# EAGLE design A-15430 (EAGLE 7.7.0)
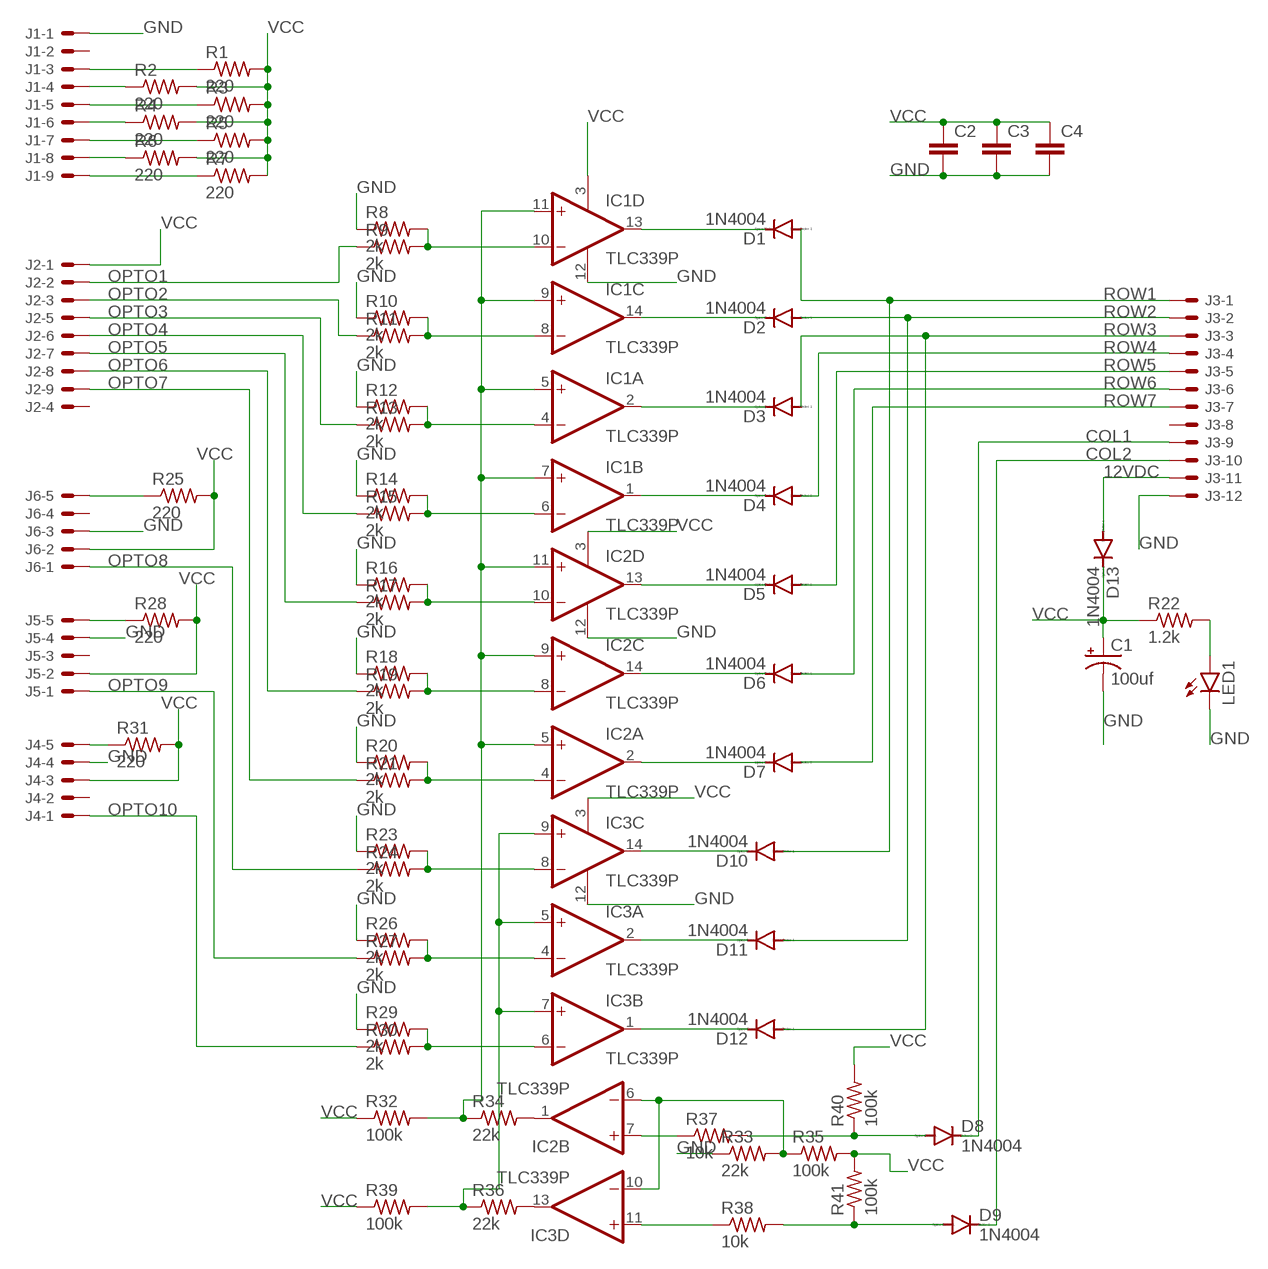
[diagram p0: schematic, sheet 1]

## Parts
C1  100uf  CPOL-USE2.5-5  [E2,5-5]
C2  C2.5/4  [C2.5-4]
C3  C2.5/4  [C2.5-4]
C4  C2.5/4  [C2.5-4]
D1  1N4004  [DO41-10]
D2  1N4004  [DO41-10]
D3  1N4004  [DO41-10]
D4  1N4004  [DO41-10]
D5  1N4004  [DO41-10]
D6  1N4004  [DO41-10]
D7  1N4004  [DO41-10]
D8  1N4004  [DO41-10]
D9  1N4004  [DO41-10]
D10  1N4004  [DO41-10]
D11  1N4004  [DO41-10]
D12  1N4004  [DO41-10]
D13  1N4004  [DO41-10]
IC1  TLC339P  [DIL14]
IC2  TLC339P  [DIL14]
IC3  TLC339P  [DIL14]
J1  KK-156-9  [KK-156-9]
J2  KK-156-9  [KK-156-9]
J3  KK-156-12  [KK-156-12]
J4  KK-156-5  [KK-156-5]
J5  KK-156-5  [KK-156-5]
J6  KK-156-5  [KK-156-5]
LED1  LED5MM  [LED5MM]
R1  220  R-US_0617/22  [0617/22]
R2  220  R-US_0617/22  [0617/22]
R3  220  R-US_0617/22  [0617/22]
R4  220  R-US_0617/22  [0617/22]
R5  220  R-US_0617/22  [0617/22]
R6  220  R-US_0617/22  [0617/22]
R7  220  R-US_0617/22  [0617/22]
R8  2k  R-US_0207/10  [0207/10]
R9  2k  R-US_0207/10  [0207/10]
R10  2k  R-US_0207/10  [0207/10]
R11  2k  R-US_0207/10  [0207/10]
R12  2k  R-US_0207/10  [0207/10]
R13  2k  R-US_0207/10  [0207/10]
R14  2k  R-US_0207/10  [0207/10]
R15  2k  R-US_0207/10  [0207/10]
R16  2k  R-US_0207/10  [0207/10]
R17  2k  R-US_0207/10  [0207/10]
R18  2k  R-US_0207/10  [0207/10]
R19  2k  R-US_0207/10  [0207/10]
R20  2k  R-US_0207/10  [0207/10]
R21  2k  R-US_0207/10  [0207/10]
R22  1.2k  R-US_0207/10  [0207/10]
R23  2k  R-US_0207/10  [0207/10]
R24  2k  R-US_0207/10  [0207/10]
R25  220  R-US_0617/22  [0617/22]
R26  2k  R-US_0207/10  [0207/10]
R27  2k  R-US_0207/10  [0207/10]
R28  220  R-US_0617/22  [0617/22]
R29  2k  R-US_0207/10  [0207/10]
R30  2k  R-US_0207/10  [0207/10]
R31  220  R-US_0617/22  [0617/22]
R32  100k  R-US_0207/10  [0207/10]
R33  22k  R-US_0207/10  [0207/10]
R34  22k  R-US_0207/10  [0207/10]
R35  100k  R-US_0207/10  [0207/10]
R36  22k  R-US_0207/10  [0207/10]
R37  10k  R-US_0207/10  [0207/10]
R38  10k  R-US_0207/10  [0207/10]
R39  100k  R-US_0207/10  [0207/10]
R40  100k  R-US_0207/10  [0207/10]
R41  100k  R-US_0207/10  [0207/10]

## Nets
12VDC [VCC]: D13.A J3.11
COL1: D8.C J3.9
COL2: D9.C J3.10
GND [GND]: C1.- C2.2 C3.2 C4.2 IC1.12(P:V-) IC2.12(P:V-) IC3.12(P:V-) J1.1 J3.12 J4.4 J5.4 J6.3 LED1.K(C) R8.1 R10.1 R12.1 R14.1 R16.1 R18.1 R20.1 R23.1 R26.1 R29.1 R33.1
N$1: D1.C IC1.13(D:OUT)
N$2: D2.C IC1.14(C:OUT)
N$3: D3.C IC1.2(A:OUT)
N$4: D4.C IC1.1(B:OUT)
N$5: J6.5 R25.1
N$6: LED1.A R22.2
N$8: J1.3 R1.1
N$9: D5.C IC2.13(D:OUT)
N$10: J1.4 R2.1
N$11: J1.5 R3.1
N$12: D6.C IC2.14(C:OUT)
N$13: J1.6 R4.1
N$14: D7.C IC2.2(A:OUT)
N$15: J1.7 R5.1
N$16: J1.8 R6.1
N$17: IC1.10(D:-IN) R8.2 R9.2
N$18: IC1.8(C:-IN) R10.2 R11.2
N$19: IC1.4(A:-IN) R12.2 R13.2
N$20: IC1.6(B:-IN) R14.2 R15.2
N$21: IC2.10(D:-IN) R16.2 R17.2
N$22: IC2.8(C:-IN) R18.2 R19.2
N$23: IC2.4(A:-IN) R20.2 R21.2
N$24: IC3.8(C:-IN) R23.2 R24.2
N$25: IC3.4(A:-IN) R26.2 R27.2
N$26: IC3.6(B:-IN) R29.2 R30.2
N$27: IC2.6(B:-IN) IC3.10(D:-IN) R33.2 R35.1
N$28: D10.C IC3.14(C:OUT)
N$29: D11.C IC3.2(A:OUT)
N$30: D12.C IC3.1(B:OUT)
N$31: J5.5 R28.1
N$32: IC3.13(D:OUT) R36.2
N$33: IC1.5(A:+IN) IC1.7(B:+IN) IC1.9(C:+IN) IC1.11(D:+IN) IC2.5(A:+IN) IC2.9(C:+IN) IC2.11(D:+IN) R32.2 R34.1
N$34: J4.5 R31.1
N$35: D9.A R38.2 R41.1
N$36: IC3.5(A:+IN) IC3.7(B:+IN) IC3.9(C:+IN) R36.1 R39.2
N$37: IC3.11(D:+IN) R38.1
N$38: J1.9 R7.1
N$39: D8.A R37.2 R40.1
N$40: IC2.1(B:OUT) R34.2
N$41: IC2.7(B:+IN) R37.1
OPTO1: J2.2 R9.1
OPTO2: J2.3 R11.1
OPTO3: J2.5 R13.1
OPTO4: J2.6 R15.1
OPTO5: J2.7 R17.1
OPTO6: J2.8 R19.1
OPTO7: J2.9 R21.1
OPTO8: J6.1 R24.1
OPTO9: J5.1 R27.1
OPTO10: J4.1 R30.1
ROW1: D1.A D10.A J3.1
ROW2: D2.A D11.A J3.2
ROW3: D3.A D12.A J3.3
ROW4: D4.A J3.4
ROW5: D5.A J3.5
ROW6: D6.A J3.6
ROW7: D7.A J3.7
VCC [VCC]: C1.+ C2.1 C3.1 C4.1 D13.C IC1.3(P:V+) IC2.3(P:V+) IC3.3(P:V+) J2.1 J4.3 J5.2 J6.2 R1.2 R2.2 R3.2 R4.2 R5.2 R6.2 R7.2 R22.1 R25.2 R28.2 R31.2 R32.1 R35.2 R39.1 R40.2 R41.2
Unconnected: J1.2 J2.4 J3.8 J4.2 J5.3 J6.4

## Library data of the parts
C1 = rcl:CPOL-US: POLARIZED CAPACITOR, American symbol; SPICEPREFIX: C
C2-C4 = capacitor-wima:C: CAPACITOR naming: grid - package width
D1-D13 = diode:1N4004: DIODE general purpose rectifier, 1 A
IC1-IC3 = linear:TLC339: COMPARATOR
J1 J2 = con-molex:KK-156-9: KK 156 HEADER Source: http://www.molex.com/pdm_docs/sd/026604100_sd.pdf; OC_FARNELL: unknown; OC_NEWARK: unknown
J3 = con-molex:KK-156-12: KK 156 HEADER Source: http://www.molex.com/pdm_docs/sd/026604100_sd.pdf; OC_FARNELL: unknown; OC_NEWARK: unknown
J4-J6 = con-molex:KK-156-5: KK 156 HEADER Source: http://www.molex.com/pdm_docs/sd/026604100_sd.pdf; OC_FARNELL: unknown; OC_NEWARK: unknown
LED1 = led:LED: LED OSRAM: - CHIPLED LG R971, LG N971, LY N971, LG Q971, LY Q971, LO R971, LY R971 LH N974, LH R974 LS Q976, LO Q976, LY Q976 LO Q996 - Hyper CHIPLED LW Q18S LB Q993, LB Q99A, LB R99A - SideLED LS A670, LO A670, LY A670, LG A670, LP A670 LB A673, LV A673, LT A673, LW A673 LH A674 LY A675 LS A676, LA A676, LO A676, LY A676, LW A676 LS A679, LY A679, LG A679 - Hyper Micro SIDELED® LS Y876, LA Y876, LO Y876, LY Y876 LT Y87S - SmartLED LW L88C, LW L88S LB L89C, LB L89S, LG L890 LS L89K, LO L89K, LY L89K LS L896, LA L896, LO L896, LY L896 - TOPLED LS T670, LO T670, LY T670, LG T670, LP T670 LSG T670, LSP T670, LSY T670, LOP T670, LYG T670 LG T671, LOG T671, LSG T671 LB T673, LV T673, LT T673, LW T673 LH T674 LS T676, LA T676, LO T676, LY T676, LB T676, LH T676, LSB T676, LW T676 LB T67C, LV T67C, LT T67C, LS T67K, LO T67K, LY T67K, LW E67C LS E67B, LA E67B, LO E67B, LY E67B, LB E67C, LV E67C, LT E67C LW T67C LS T679, LY T679, LG T679 LS T770, LO T770, LY T770, LG T770, LP T770 LB T773, LV T773, LT T773, LW T773 LH T774 LS E675, LA E675, LY E675, LS T675 LS T776, LA T776, LO T776, LY T776, LB T776 LHGB T686 LT T68C, LB T68C - Hyper Mini TOPLED® LB M676 - Mini TOPLED Santana® LG M470 LS M47K, LO M47K, LY M47K Source: http://www.osram.convergy.de LUXEON: - LUMILED® LXK2-PW12-R00, LXK2-PW12-S00, LXK2-PW14-U00, LXK2-PW14-V00 LXK2-PM12-R00, LXK2-PM12-S00, LXK2-PM14-U00 LXK2-PE12-Q00, LXK2-PE12-R00, LXK2-PE12-S00, LXK2-PE14-T00, LXK2-PE14-U00 LXK2-PB12-K00, LXK2-PB12-L00, LXK2-PB12-M00, LXK2-PB14-N00, LXK2-PB14-P00, LXK2-PB14-Q00 LXK2-PR12-L00, LXK2-PR12-M00, LXK2-PR14-Q00, LXK2-PR14-R00 LXK2-PD12-Q00, LXK2-PD12-R00, LXK2-PD12-S00 LXK2-PH12-R00, LXK2-PH12-S00 LXK2-PL12-P00, LXK2-PL12-Q00, LXK2-PL12-R00 Source: www.luxeon.com KINGBRIGHT: KA-3528ASYC Source: www.kingbright.com
R1-R41 = rcl:R-US_: RESISTOR, American symbol; SPICEPREFIX: R

## Net classes
0 default: width 0.635 mm, drill 0.318 mm, clearance 0.15 mm
1 VCC: width 1.27 mm, drill 0.635 mm, clearance 0.15 mm
2 GND: width 1.27 mm, drill 0.635 mm, clearance 0.15 mm

## Board
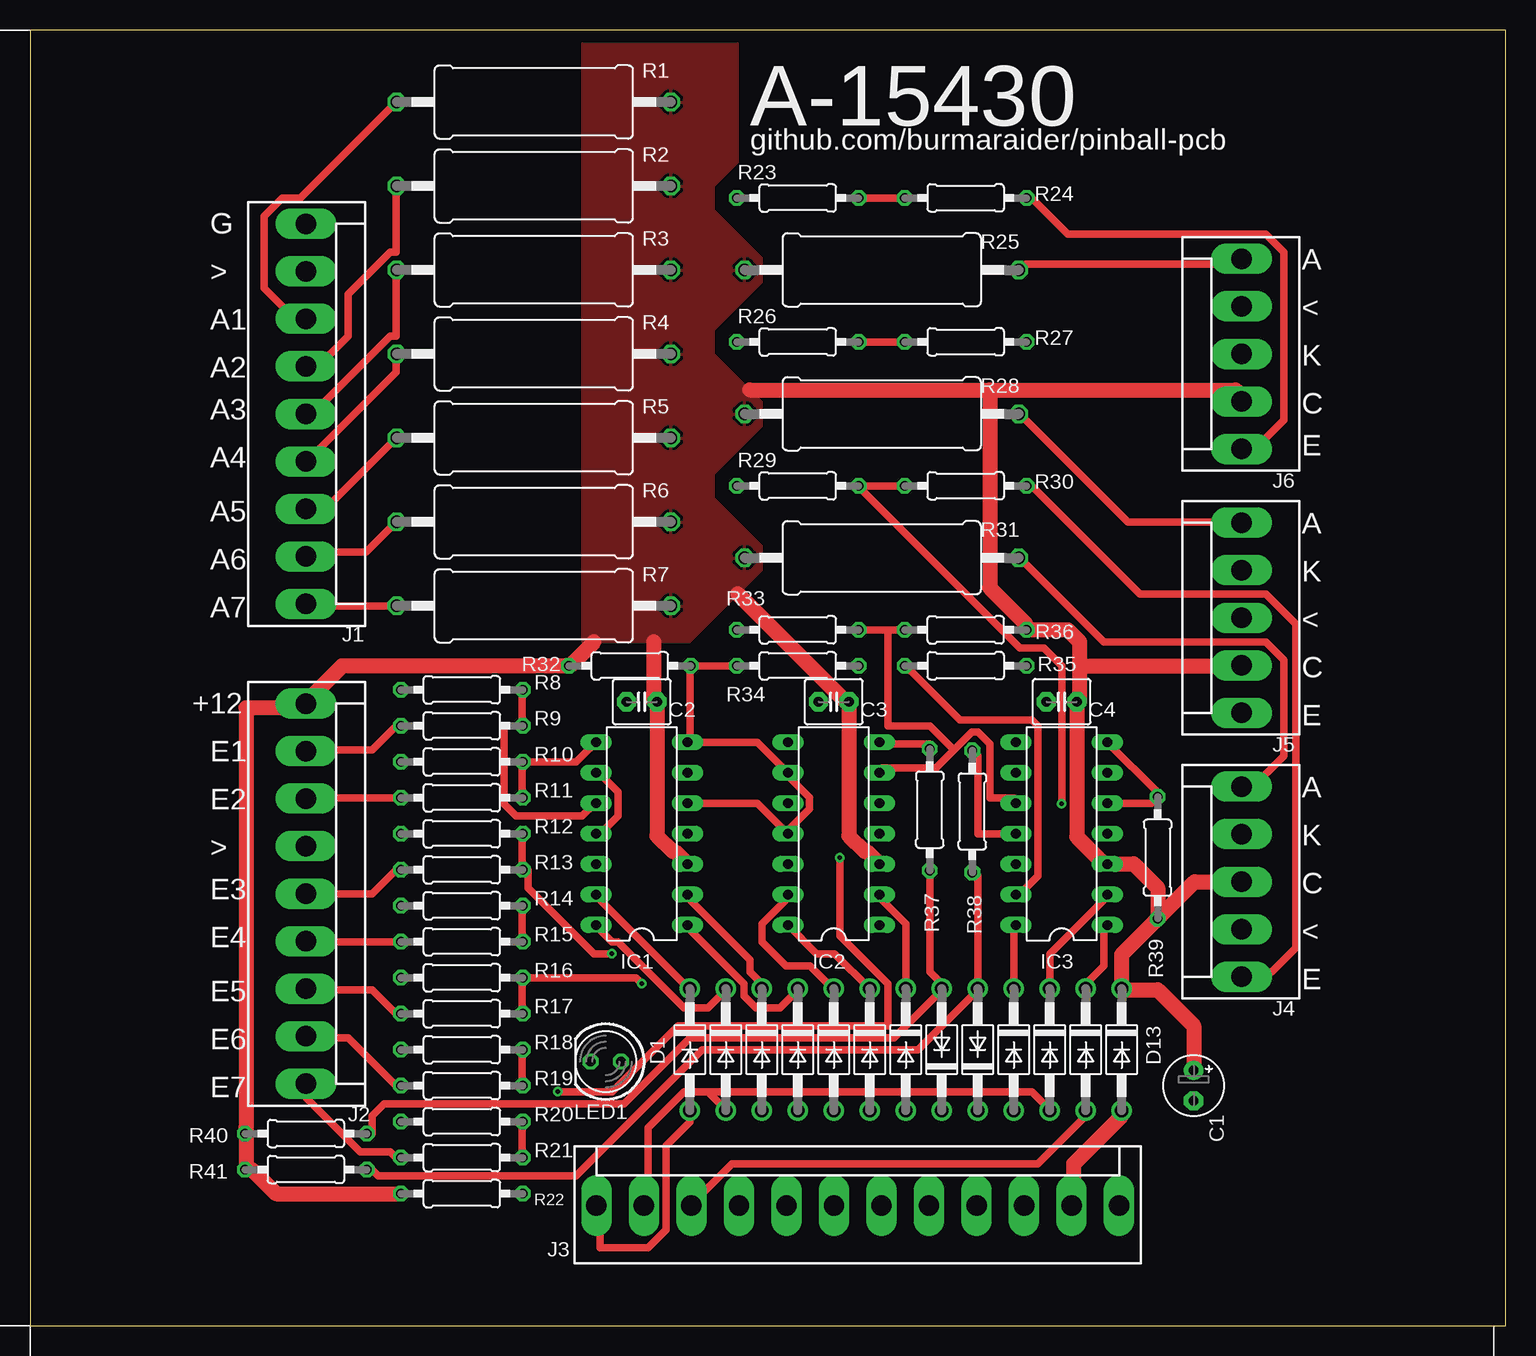
[diagram p1: board, top side]
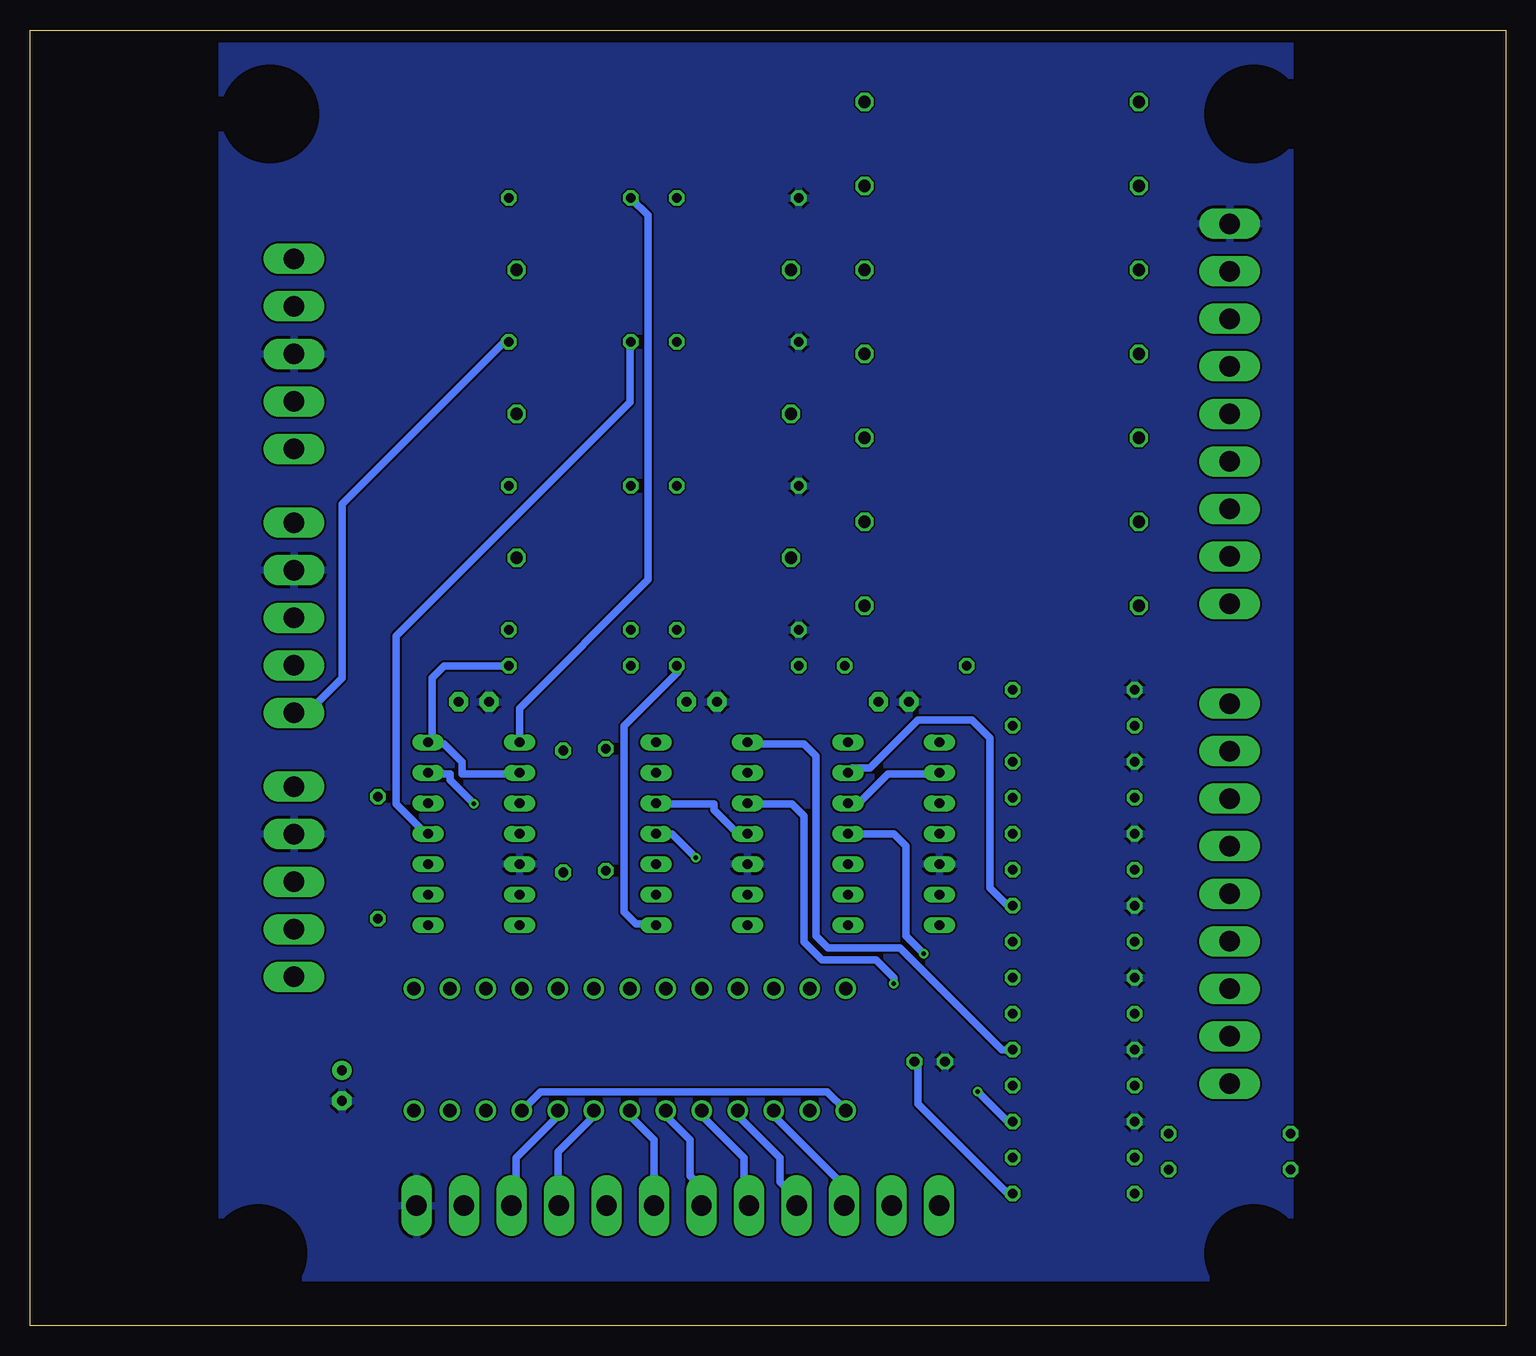
[diagram p2: board, bottom side, seen from below]

Size 123 x 108 mm. Coordinates in mm from the lower left corner, seen from the top.
Outline: 0,0 123,0 123,108 0,108 0,0
Copper layers (1*16): Top 0.035mm / dielectric 1.5mm / Bottom 0.035mm
Design rules "default": minimum track width 6mil, minimum drill 0.35mm, track to track 6mil, track to pad 6mil, pad to pad 6mil, via to via 6mil, smd to smd 6mil, copper to edge 40mil, drill to drill 6mil, minimum pad ring 10mil, minimum via ring 8mil, stop-mask expansion 4mil, vias tented up to drill 0mil, thermal gap 10mil
bRestrict: area 100,2 to 108,10; area 17,2 to 25,10; area 17,97 to 25,105; area 99,97 to 107,105

### Footprints (pad centres in the part's own frame; a part is rotated, then mirrored left to right if it is on the bottom)
E2,5-5 = drill 0.813 pad 1.6: + -1.27,0 | drill 0.813 pad 1.6 octagon: - 1.27,0
C2.5-4 = drill 0.813 pad 1.6 octagon: 1 -1.27,0; 2 1.27,0
DO41-10 = drill 1.118: A 5.08,0; C -5.08,0
DIL14 = drill 0.813 long: 1 -7.62,-3.81; 2 -5.08,-3.81; 3 -2.54,-3.81; 4 0,-3.81; 5 2.54,-3.81; 6 5.08,-3.81; 7 7.62,-3.81; 8 7.62,3.81; 9 5.08,3.81; 10 2.54,3.81; 11 0,3.81; 12 -2.54,3.81; 13 -5.08,3.81; 14 -7.62,3.81
KK-156-9 = drill 1.7 pad 2.184 long: 1 -15.84,0; 2 -11.88,0; 3 -7.92,0; 4 -3.96,0; 5 0,0; 6 3.96,0; 7 7.92,0; 8 11.88,0; 9 15.84,0
KK-156-12 = drill 1.7 pad 2.184 long: 1 -21.78,0; 2 -17.82,0; 3 -13.86,0; 4 -9.9,0; 5 -5.94,0; 6 -1.98,0; 7 1.98,0; 8 5.94,0; 9 9.9,0; 10 13.86,0; 11 17.82,0; 12 21.78,0
KK-156-5 = drill 1.7 pad 2.184 long: 1 -7.92,0; 2 -3.96,0; 3 0,0; 4 3.96,0; 5 7.92,0
LED5MM = drill 0.813 octagon: A -1.27,0; K 1.27,0
0617/22 = drill 1.016 octagon: 1 -11.43,0; 2 11.43,0
0207/10 = drill 0.813 octagon: 1 -5.08,0; 2 5.08,0

### Placement (x,y rotation side)
C1  97,20 270 top
C2  51,52 180 top
C3  67,52 180 top
C4  86,52 180 top
D1  55,23 270 top
D2  58,23 270 top
D3  61,23 270 top
D4  64,23 270 top
D5  67,23 270 top
D6  70,23 270 top
D7  73,23 270 top
D8  76,23 90 top
D9  79,23 90 top
D10  82,23 270 top
D11  85,23 270 top
D12  88,23 270 top
D13  91,23 270 top
IC1  51,41 90 top
IC2  67,41 90 top
IC3  86,41 90 top
J1  23,76 270 top
J2  23,36 270 top
J3  69,10 0 top
J4  101,37 90 top
J5  101,59 90 top
J6  101,81 90 top
LED1  48,22 180 top
R1  42,102 0 top
R2  42,95 0 top
R3  42,88 0 top
R4  42,81 0 top
R5  42,74 0 top
R6  42,67 0 top
R7  42,60 0 top
R8  36,53 0 top
R9  36,50 0 top
R10  36,47 0 top
R11  36,44 0 top
R12  36,41 0 top
R13  36,38 0 top
R14  36,35 0 top
R15  36,32 0 top
R16  36,29 0 top
R17  36,26 0 top
R18  36,23 0 top
R19  36,20 0 top
R20  36,17 0 top
R21  36,14 0 top
R22  36,11 0 top
R23  64,94 0 top
R24  78,94 180 top
R25  71,88 180 top
R26  64,82 0 top
R27  78,82 180 top
R28  71,76 180 top
R29  64,70 0 top
R30  78,70 180 top
R31  71,64 180 top
R32  50,55 0 top
R33  64,58 0 top
R34  64,55 0 top
R35  78,58 0 top
R36  78,55 180 top
R37  75,43 270 top
R38  78.55,42.85 270 top
R39  94,39 90 top
R40  23,16 180 top
R41  23,13 180 top

### Tracks (layer width: path | path; a pad name or v marks a point on that pad's centre or on a via)
12VDC
  Top 1.27: D13.A 91,17.5 87,13.5 87,10 J3.11
COL1
  Bottom 0.635: D8.C 76,17.5 79,14.5 79,10 J3.9
COL2
  Bottom 0.635: D9.C 79,17.5 82.5,14 82.5,10 J3.10
GND
  pour Bottom: 18,107 18,4 107,4 107,107
N$1
  Top 0.635: IC1.13 47.5,35.5 54.5,28.5 55,28.5 D1.C
N$2
  Top 0.635: IC1.14 47.5,33 48.5,32 49,32 54.5,26.5 56.5,26.5 58,28 D2.C
N$3
  Top 0.635: IC1.2 55,35.5 60,30.5 60,29.5 61,28.5 D3.C
N$4
  Top 0.635: IC1.1 55,33 59.5,28.5 59.5,27.5 60.5,26.5 62.5,26.5 64,28 D4.C
N$5
  Top 0.635: R25.1 82.5,88 83,88.5 101,88.5 J6.5
N$6
  Bottom 0.635: R22.2 41.5,11 49,18.5 49,22 LED1.A
N$8
  Top 0.635: R1.1 30.5,102 22.5,94 21,94 19.5,92.5 19.5,86.5 22,84 23,84 J1.3
N$9
  Top 0.635: IC2.13 63,35.5 61,33.5 61,32 63,30 65,30 66.5,28.5 67,28.5 D5.C
N$10
  Top 0.635: R2.1 30.5,95 30.5,89.5 30,89.5 26.5,86 26.5,82.5 24,80 23,80 J1.4
N$11
  Top 0.635: J1.5 23.5,76.5 24,76.5 27.5,80 30,82.5 30.5,82.5 30.5,88 R3.1
N$12
  Top 0.635: IC2.14 65.57,31 67.08,31 D6.C
N$13
  Top 0.635: R4.1 30.5,81 30.5,79.5 23.5,72.5 23,72.5 J1.6
N$14
  Top 0.635: D7.C 73,33.5 71,35.5 IC2.2
N$15
  Top 0.635: R5.1 30.5,74 25,68.5 23,68.5 J1.7
N$16
  Top 0.635: R6.1 30.5,67 28,64.5 23,64.5 J1.8
N$17
  Top 0.635: 41,50 41,53 R8.2 | 41,50 39.5,50 39.5,43.5 40.5,42.5 46,42.5 47,43.5 IC1.10 | 41,50 R9.2
N$18
  Top 0.635: R11.2 41,44 41,47 R10.2 45.5,47 47,48.5 IC1.8
N$19  (via drill 0.35)
  Top 0.635: R12.2 41,41 41,38 R13.2 41.5,38 41.5,36.5 47,31 v48.5,31
  Bottom 0.635: IC1.4 51,41 50,40 50,32.5 v48.5,31
N$20
  Top 0.635: R15.2 41,32 41,35 R14.2
  Bottom 0.635: IC1.6 54.5,46.5 53,46.5 49,50.5 44.5,50.5 43,49 43,36.5 41.5,35 R14.2
N$21  (via drill 0.35)
  Top 0.635: R17.2 41,26 41,29 R16.2 50.5,29 v51,28.5
  Bottom 0.635: v51,28.5 51,29 52.5,30.5 57,30.5 58.5,32 58.5,42.5 59.5,43.5 63,43.5 IC2.10
N$22
  Top 0.635: R19.2 41,20 41,23 R18.2
  Bottom 0.635: R18.2 42,23 50.5,31.5 56.5,31.5 57.5,32.5 57.5,47.5 58.5,48.5 63,48.5 IC2.8
N$23  (via drill 0.35)
  Top 0.635: R21.2 41,14 41,17 R20.2 | v67.5,39 67.5,32.5 69,31 71.5,28.5 71.5,25 54,25 48.5,19.5 v44,19.5
  Bottom 0.635: v67.5,39 69.5,41 IC2.4 | v44,19.5 41.5,17 R20.2
N$24
  Top 0.635: R24.2 R23.2
  Bottom 0.635: R24.2 71.47,92.55 71.47,62.18 82.19,51.46 IC3.8
N$25
  Top 0.635: R27.2 R26.2
  Bottom 0.635: IC3.4 90,41 92.5,43.5 92.5,57.5 73,77 73,82 R27.2
N$26  (via drill 0.35)
  Top 0.635: R30.2 R29.2 69,70 82.5,56.5 84.5,56.5 86,55 v86,43.5
  Bottom 0.635: v86,43.5 88,45.5 88,46 89.5,46 IC3.6
N$27
  Top 0.635: R35.1 71.5,58 | 71.5,58 R33.2 | 77,48 78.5,49.5 79,49.5 80,48.5 80,44 82,44 IC3.10 | 77,48 75.5,46.5 71,46.5 IC2.6 | 71.5,58 71.5,50 75,50 77,48
N$28
  Top 0.635: D10.C 82,33 IC3.14
N$29
  Top 0.635: D11.C 85,31 89.5,35.5 IC3.2
N$30
  Top 0.635: IC3.1 89.5,33 89.5,30 88,28.5 D12.C
N$31
  Top 0.635: R28.1 82.5,76 91.5,67 101,67 J5.5
N$32
  Top 0.635: IC3.13 82.5,36 84,37.5 84,50 83.5,50.5 77.5,50.5 73,55 R36.2
N$33
  Top 0.635: IC1.11 47.5,41 49,42.5 49,44.5 47.5,46 IC1.9 | R34.1 R32.2 55,55 55,49 IC1.7 60.65,48.62 IC2.9 63.19,45.8 64.98,44.01 64.98,43.07 63.19,41.28 IC2.11 60.65,43.54 IC1.5
  Bottom 0.635: IC2.11 64,41 66,43 66,43.5 70.5,43.5 IC2.5 | IC1.9 47.5,46 51.5,46 54,43.5 54.5,43.5 IC1.5
N$34
  Top 0.635: R31.1 82.5,64 89.5,57 103,57 104.5,55.5 104.5,47.5 102,45 101,45 J4.5
N$35
  Top 0.635: R41.1 28.5,13 29,12.5 45.5,12.5 56,23 74,23 79,28 D9.A 79,37.5 R38.2
N$36
  Top 0.635: IC3.7 94,44.43 R39.2 93.46,43.54 IC3.5
  Bottom 0.635: IC3.9 82.5,46 87,46 87,47 88.5,48.5 89.5,48.5 IC3.7 89.5,49 89.5,54 88.5,55 R36.1
N$37
  Top 0.635: IC3.11 79,41 79,47.5 R38.1
N$38
  Top 0.635: R7.1 23,60 J1.9
N$39
  Top 0.635: R40.1 28.5,16 28.5,17.5 29.5,18.5 49.5,18.5 55,24 72,24 76,28 D8.A 76,28.5 75,29.5 R37.2
N$40
  Bottom 0.635: IC2.1 71,33.5 72.5,33.5 73.5,34.5 73.5,50 69,54.5 69,55 R34.2
N$41
  Top 0.635: IC2.7 71,48.5 75,48.5 R37.1
OPTO1
  Top 0.635: R9.1 30.5,50 28.5,48 23,48 J2.2
OPTO2
  Top 0.635: R11.1 23,44 J2.3
OPTO3
  Top 0.635: J2.5 28.5,36 30.5,38 R13.1
OPTO4
  Top 0.635: R15.1 23,32 J2.6
OPTO5
  Top 0.635: R17.1 30.5,26 28.5,28 23,28 J2.7
OPTO6
  Top 0.635: R19.1 30.5,20 26.5,24 23,24 J2.8
OPTO7
  Top 0.635: J2.9 23,19 27.5,14.5 30,14.5 30.5,14 R21.1
OPTO8
  Top 0.635: R24.1 83.5,94 86.5,91 103,91 104.5,89.5 104.5,75.5 102.5,73.5 101,73.5 J6.1
OPTO9
  Bottom 0.635: R27.1 83.5,82 97,68.5 97,54 99.5,51.5 101,51.5 J5.1
OPTO10
  Top 0.635: R30.1 83.5,70 92.5,61 103,61 105.5,58.5 105.5,31.5 103.5,29.5 101,29.5 J4.1
ROW1
  Top 0.635: J3.1 47.5,10 47.5,6.5 51.5,6.5 53,8 53,15 55,17 D1.A
  Bottom 0.635: D1.A 56.58,19.5 80.42,19.5 D10.A
ROW2
  Top 0.635: 56.5,19.5 58,18 D2.A | 56.5,19.5 54.5,19.5 51.5,16.5 51.5,10 J3.2 | 56.5,19.5 83.5,19.5 85,18 D11.A
ROW3
  Top 0.635: D12.A 88,17.5 84,13.5 58.5,13.5 55,10 J3.3
  Bottom 0.635: D3.A 61,17.5 55.5,12 55.5,10 J3.3
ROW4
  Bottom 0.635: D4.A 64,17.5 60.5,14 60.5,12 59.5,11 59.5,10 J3.4
ROW5
  Bottom 0.635: D5.A 67,17.5 63.5,14 63.5,10 J3.5
ROW6
  Bottom 0.635: D6.A 70,17.5 68,15.5 68,12.5 67.5,12 67.5,10 J3.6
ROW7
  Bottom 0.635: D7.A 73,17.5 71,15.5 71,10 J3.7
VCC
  Top 1.27: C1.+ 97,25 94,28 91,28 D13.C 91,30.92 R39.1 | 87.5,55 87.5,52 C4.1 87.27,40.73 89.54,38.46 IC3.3 91.96,38.46 92,38.5 94,36.5 R39.1 | 87.5,55 87.5,57 86.5,58 R35.2 83,58.5 80,61.5 80,78 | 87.5,55 101,55 J5.2 | R22.1 20.5,11 18.5,13 R41.2 18,13 18,16 R40.2 18,16.5 18,51.5 22.5,51.5 J2.1 23,52 26,55 R32.1 45,55 47,57 | 52,57 52,52 C2.1 52.27,40.83 53.55,39.55 53.72,39.55 IC1.3 | 60,78 80,78 | 80,78 100.5,78 101,77.5 J6.2 | 59,61 68,52 C3.1 68.27,40.83 69.55,39.55 69.72,39.55 IC2.3 | R39.1 97.08,37 J4.3
  pour Top: 46,107 46,57 55,57 61,63 61,65 57,69 57,71 61,75 61,77 57,81 57,83 61,87 61,89 57,93 57,95 59,97 59,107

### Text on the board
tPlace: github.com/burmaraider/pinball-pcb
tNames: A-15430 | G | A | > | < | A1 | K | A2 | A3 | C | A4 | E | A5 | A | A6 | K | A7 | < | C | +12 | E | E1 | A | E2 | K | > | E3 | C | E4 | < | E | E5 | E6 | E7